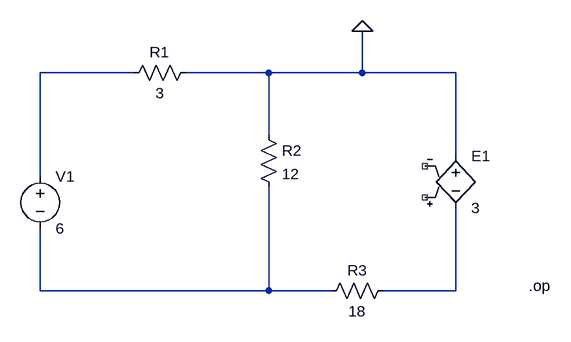
[diagram p0: schematic Draft6.asc]
Draft6.asc, the LTspice schematic file:
Version 4
SHEET 1 880 680
WIRE 176 144 32 144
WIRE 384 144 256 144
WIRE 528 144 528 80
WIRE 528 144 384 144
WIRE 672 144 528 144
WIRE 384 240 384 144
WIRE 672 272 672 144
WIRE 32 304 32 144
WIRE 32 480 32 384
WIRE 384 480 384 320
WIRE 384 480 32 480
WIRE 480 480 384 480
WIRE 672 480 672 352
WIRE 672 480 560 480
FLAG 528 80 0
FLAG 528 80 0
SYMBOL voltage 32 288 R0
SYMATTR InstName V1
SYMATTR Value 6
SYMBOL Res 272 128 R90
WINDOW 0 0 56 VBottom 2
WINDOW 3 32 56 VTop 2
SYMATTR InstName R1
SYMATTR Value 3
SYMBOL res 368 224 R0
SYMATTR InstName R2
SYMATTR Value 12
SYMBOL e2 672 256 R0
SYMATTR InstName E1
SYMATTR Value 3
SYMBOL res 576 464 R90
WINDOW 0 0 56 VBottom 2
WINDOW 3 32 56 VTop 2
SYMATTR InstName R3
SYMATTR Value 18
TEXT 784 472 Left 2 !.op

The netlist it stands for:
* Draft6.asc
V1 N001 N002 6
R1 0 N001 3
R2 0 N002 12
E1 0 N003 NC_01 NC_02 3
R3 N003 N002 18
.op
.backanno
.end